# Altium schematic sheet Sheet1.SchDoc
size A; SheetNumber: 1; SheetTotal: 1
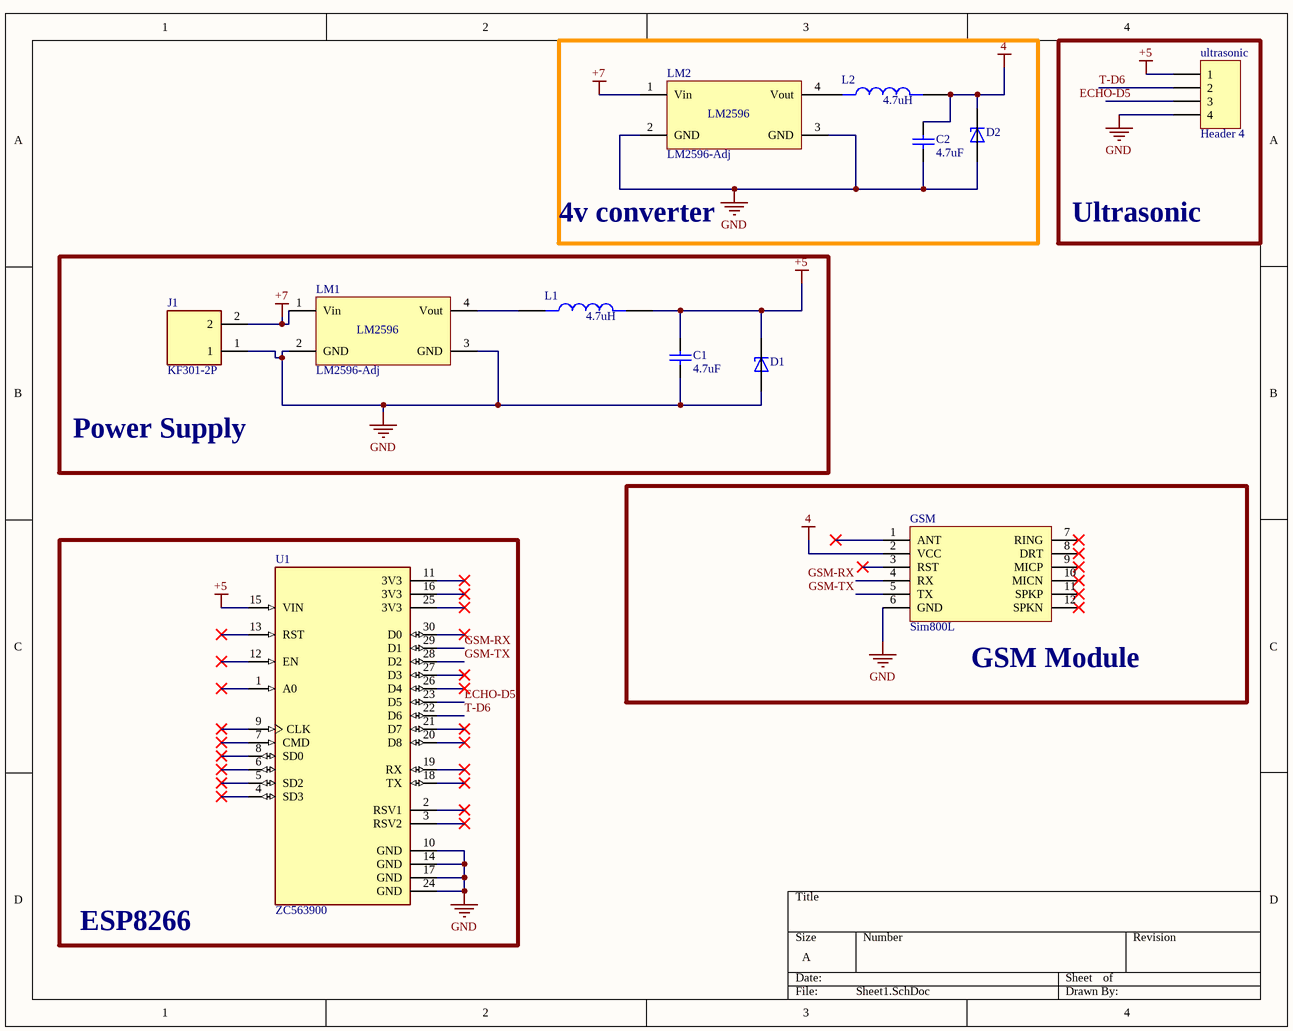
[diagram p0: Sheet1.SchDoc]

## Parts
C1  value 4.7uF  [RAD-0.3]  (hidden comment: Cap)
C2  value 4.7uF  [RAD-0.3]  (hidden comment: Cap)
D1  P6KE6.8A  [DIOAD1300W80L670D310]  (value not drawn)
D2  P6KE6.8A  [DIOAD1300W80L670D310]  (value not drawn)
GSM  Sim800L  [Sim800L]
J1  KF301-2P  [HANDSON_KF301-2P]
L1  value 4.7uH  [INDAD1680W80L1200D650]  (hidden comment: B82145A1474J000)
L2  value 4.7uH  [INDAD1680W80L1200D650]  (hidden comment: B82145A1474J000)
LM1  LM2596-Adj  [lm2596]
LM2  LM2596-Adj  [lm2596]
U1  ZC563900  [MODULE_ZC563900]
ultrasonic  Header 4  [HDR1X4]

## Blocks framed on the sheet
4v converter: C2 D2 L2 LM2
Ultrasonic: ultrasonic
Power Supply: C1 D1 J1 L1 LM1
GSM Module: GSM
ESP8266: U1

## Nets
4: C2.2 D2.C GSM.2(VCC) L2.2
+5: C1.2 D1.C L1.2 U1.15(VIN) ultrasonic.1
+7: J1.2 LM1.1(Vin) LM2.1(Vin)
GND: C1.1 C2.1 D1.A D2.A GSM.6(GND) J1.1 LM1.2(GND) LM1.3(GND) LM2.2(GND) LM2.3(GND) U1.10(GND) U1.14(GND) U1.17(GND) U1.24(GND) ultrasonic.4
ECHO-D5: U1.23(D5) ultrasonic.3
GSM-RX: GSM.4(RX) U1.29(D1)
GSM-TX: GSM.5(TX) U1.28(D2)
T-D6: U1.22(D6) ultrasonic.2
NetL1_1: L1.1 LM1.4(Vout)

Not connected (* = marked no-connect by the designer): GSM 1(ANT)* 3(RST)* 7(RING)* 8(DRT)* 9(MICP)* 10(MICN)* 11(SPKP)* 12(SPKN)*; L2 1; LM2 4(Vout); U1 1(A0)* 2(RSV1)* 3(RSV2)* 4(SD3)* 5(SD2)* 6(SD1)* 7(CMD)* 8(SD0)* 9(CLK)* 11(3V3)* 12(EN)* 13(RST)* 16(3V3)* 18(TX)* 19(RX)* 20(D8)* 21(D7)* 25(3V3)* 26(D4)* 27(D3)* 30(D0)*

## Notes on the sheet
- (in symbol LM2596-Adj) LM2596

## Library data of the parts
C1 C2 = Cap: Capacitor; Published: 8-Jun-2000; LatestRevisionDate: 17-Jul-2002; LatestRevisionNote: Re-released for DXP Platform.; PackageReference: RAD-0.3; Publisher: Altium Limited; PackageDescription: Radial Cap, Thru-Hole; 2 Leads; 0.3 in Pin Spacing
D1 D2 = P6KE6.8A: 10.5V Clamp 58.1A Ipp Tvs Diode Through Hole DO-204AC (DO-15); MF: Littelfuse Inc.; SnapEDA_Link: https://www.snapeda.com/parts/P6KE6.8A/Littelfuse/view-part/?ref=snap; Package: DO-15 Littelfuse Inc.; Value: *; MP: P6KE6.8A; Check_prices: https://www.snapeda.com/parts/P6KE6.8A/Littelfuse/view-part/?ref=eda
J1 = KF301-2P: 2 Pin Terminal Block 5mm Pitch; MF: Handson Technology; SnapEDA_Link: https://www.snapeda.com/parts/KF301-2P/Handson+Technology/view-part/?ref=snap; Package: None; Value: *; MP: KF301-2P; Check_prices: https://www.snapeda.com/parts/KF301-2P/Handson+Technology/view-part/?ref=eda
L1 L2 = B82145A1474J000: 470 ÂµH Unshielded Wirewound Inductor 510 mA 1.9Ohm Max Axial; MF: EPCOS; Price: None; Check_prices: https://www.snapeda.com/parts/B82145A1474J000/EPCOS/view-part/?ref=eda; Package: None; Purchase-URL: https://pricing.snapeda.com/search/part/B82145A1474J000/?ref=eda; Availability: In Stock; MP: B82145A1474J000; SnapEDA_Link: https://www.snapeda.com/parts/B82145A1474J000/EPCOS/view-part/?ref=snap
LM1 LM2 = LM2596-Adj: Designed By @Alixahedi
U1 = ZC563900: NodeMcu Lua ESP8266 WIFI Internet of Things Network Development Module Board; MF: YKS; Value: *; SnapEDA_Link: https://www.snapeda.com/parts/ZC563900/YKS/view-part/?ref=snap; Availability: Not in stock; Price: None; Package: None; Check_prices: https://www.snapeda.com/parts/ZC563900/YKS/view-part/?ref=eda; MP: ZC563900
ultrasonic = Header 4: Header, 4-Pin; LatestRevisionDate: 17-Jul-2002; LatestRevisionNote: Re-released for DXP Platform.; Publisher: Altium Limited